# Altium project PWR_MNG.PRJPCB
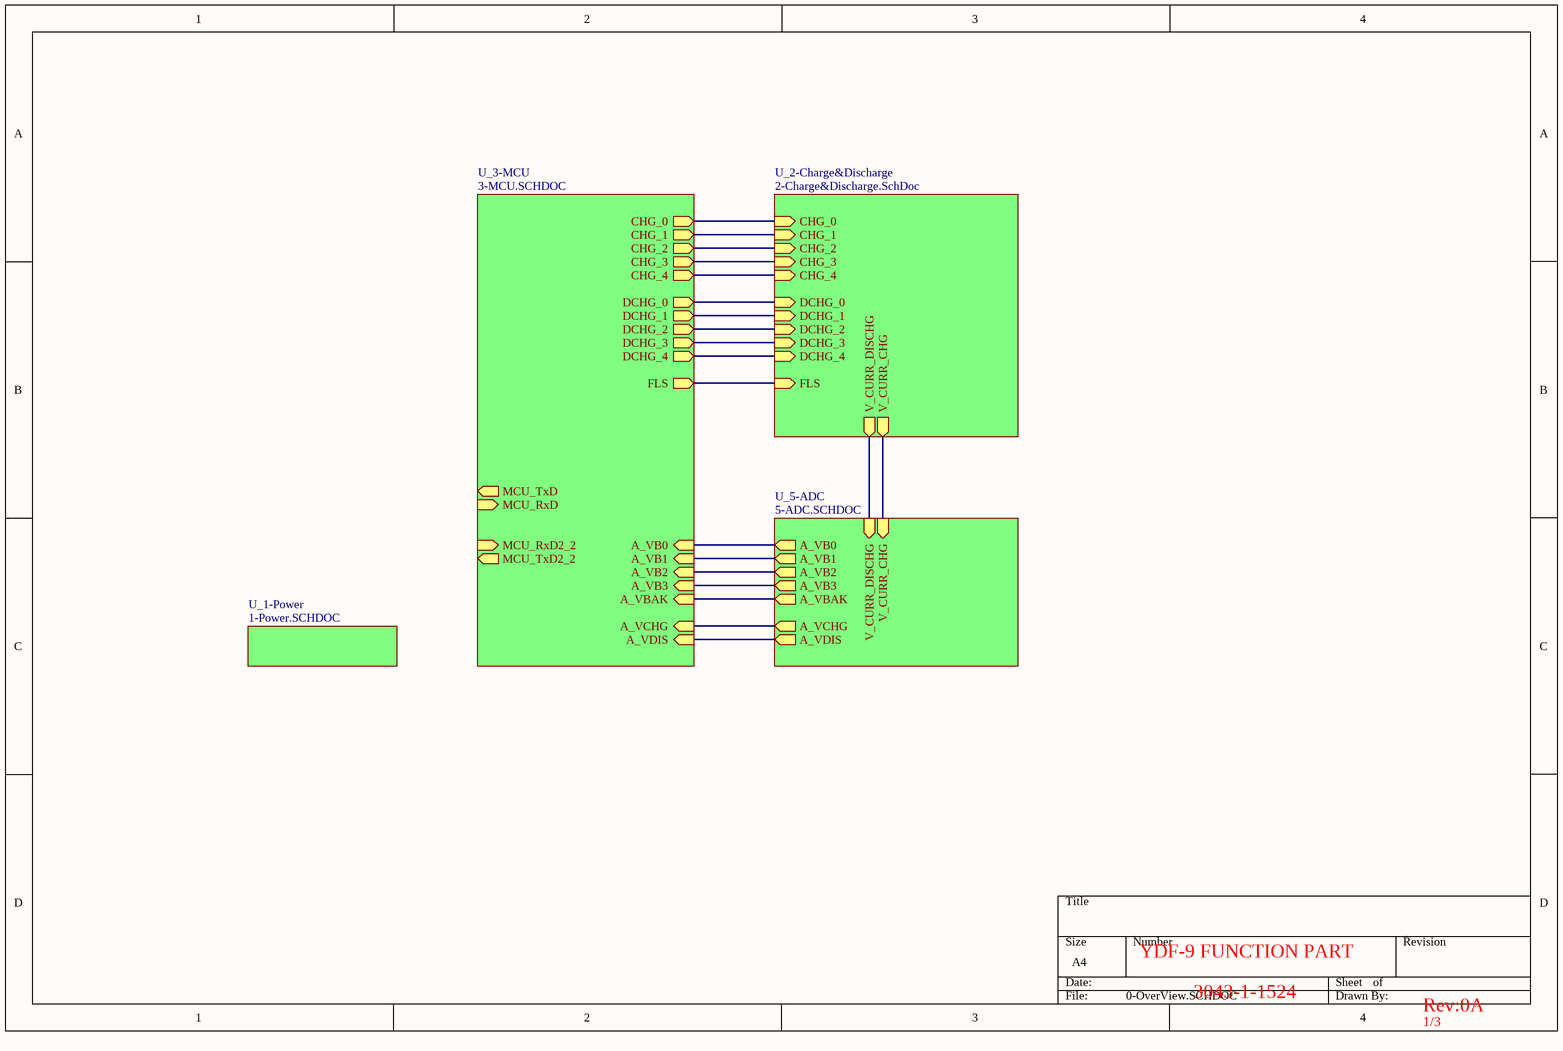
[diagram p0: 0-OverView.SCHDOC]
.TITLE: aaaaa
5 sheets, 60 parts. Net scope: hierarchical (ports join the sheet entries above them; power ports are global).
Board file: 3043-1-1552.PcbDoc
Sheets:
  0-OverView.SCHDOC
    U_2-Charge&Discharge = 2-Charge&Discharge.SchDoc
    U_1-Power = 1-Power.SCHDOC
    U_3-MCU = 3-MCU.SCHDOC
    U_5-ADC = 5-ADC.SCHDOC

## Sheet 0-OverView.SCHDOC
size A4

### Sub-sheets
U_1-Power = 1-Power.SCHDOC: no entries
U_2-Charge&Discharge = 2-Charge&Discharge.SchDoc: V_CURR_CHG (out), V_CURR_DISCHG (out), CHG_2 (in), CHG_3 (in), DCHG_0 (in), CHG_4 (in), CHG_0 (in), DCHG_1 (in), CHG_1 (in), DCHG_2 (in), DCHG_3 (in), DCHG_4 (in), FLS (in)
U_3-MCU = 3-MCU.SCHDOC: A_VDIS (in), A_VCHG (in), A_VB1 (in), A_VB2 (in), A_VB3 (in), MCU_RxD2_2 (in), MCU_TxD2_2 (out), MCU_RxD (in), CHG_3 (out), CHG_4 (out), CHG_0 (out), CHG_1 (out), CHG_2 (out), DCHG_0 (out), DCHG_1 (out), DCHG_2 (out), DCHG_3 (out), MCU_TxD (out), DCHG_4 (out), A_VB0 (in), A_VBAK (in), FLS (out)
U_5-ADC = 5-ADC.SCHDOC: A_VDIS (out), A_VB3 (out), A_VB1 (out), A_VCHG (out), A_VB2 (out), V_CURR_DISCHG (in), V_CURR_CHG (in), A_VB0 (out), A_VBAK (out)

### Nets
A_VB0: sheet U_3-MCU/A_VB0, sheet U_5-ADC/A_VB0
A_VB1: sheet U_3-MCU/A_VB1, sheet U_5-ADC/A_VB1
A_VB2: sheet U_3-MCU/A_VB2, sheet U_5-ADC/A_VB2
A_VB3: sheet U_3-MCU/A_VB3, sheet U_5-ADC/A_VB3
A_VBAK: sheet U_3-MCU/A_VBAK, sheet U_5-ADC/A_VBAK
A_VCHG: sheet U_2-Charge&Discharge/V_CURR_CHG, sheet U_3-MCU/A_VCHG, sheet U_5-ADC/A_VCHG, sheet U_5-ADC/V_CURR_CHG
A_VDIS: sheet U_2-Charge&Discharge/V_CURR_DISCHG, sheet U_3-MCU/A_VDIS, sheet U_5-ADC/A_VDIS, sheet U_5-ADC/V_CURR_DISCHG
CHG_0: sheet U_2-Charge&Discharge/CHG_0, sheet U_3-MCU/CHG_0
CHG_1: sheet U_2-Charge&Discharge/CHG_1, sheet U_3-MCU/CHG_1
CHG_2: sheet U_2-Charge&Discharge/CHG_2, sheet U_3-MCU/CHG_2
CHG_3: sheet U_2-Charge&Discharge/CHG_3, sheet U_3-MCU/CHG_3
CHG_4: sheet U_2-Charge&Discharge/CHG_4, sheet U_3-MCU/CHG_4
DCHG_0: sheet U_2-Charge&Discharge/DCHG_0, sheet U_3-MCU/DCHG_0
DCHG_1: sheet U_2-Charge&Discharge/DCHG_1, sheet U_3-MCU/DCHG_1
DCHG_2: sheet U_2-Charge&Discharge/DCHG_2, sheet U_3-MCU/DCHG_2
DCHG_3: sheet U_2-Charge&Discharge/DCHG_3, sheet U_3-MCU/DCHG_3
DCHG_4: sheet U_2-Charge&Discharge/DCHG_4, sheet U_3-MCU/DCHG_4
FLS: sheet U_2-Charge&Discharge/FLS, sheet U_3-MCU/FLS

### Notes on the sheet
- YDF-9 FUNCTION PART
- 3043-1-1524
- Rev:0A
- 1/3

## Sheet 2-Charge&Discharge.SchDoc
size A4
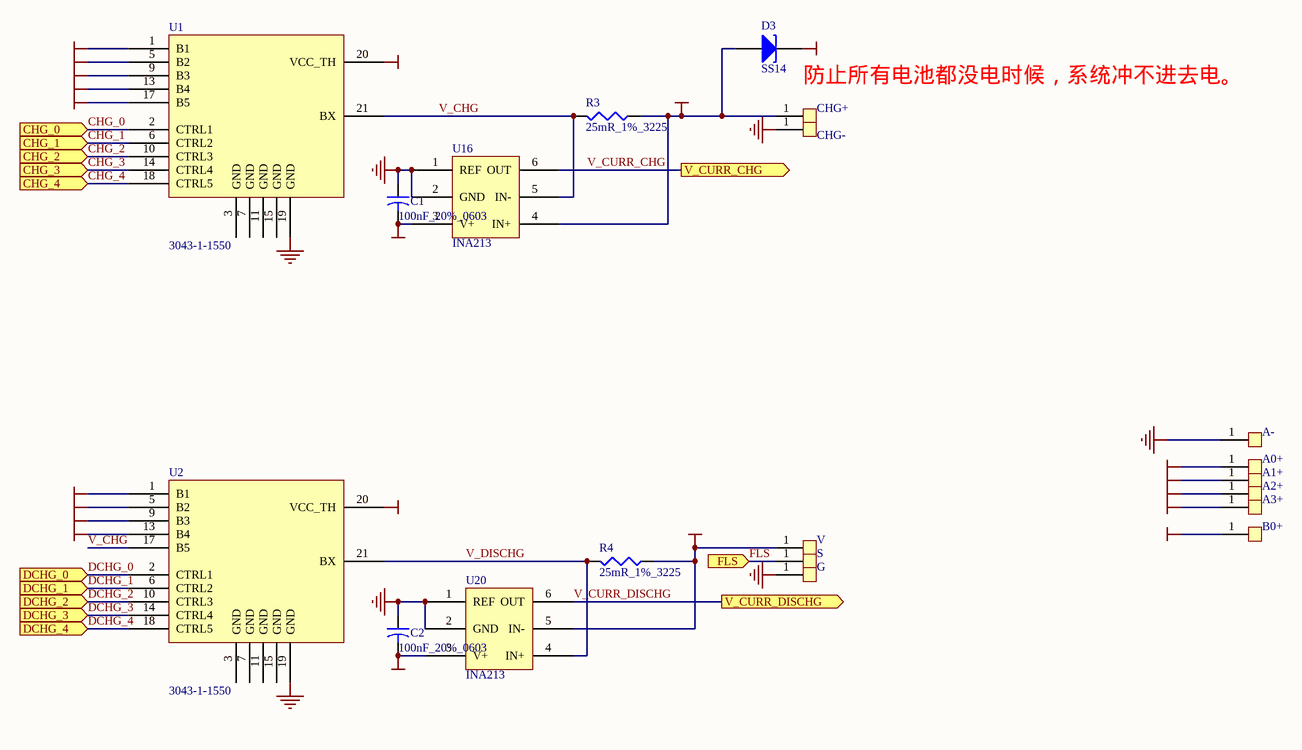
[diagram p1: 2-Charge&Discharge.SchDoc]

### Parts
A0+  ND  [END_1.5_2.8]  (value not drawn)
A1+  ND  [END_1.5_2.8]  (value not drawn)
A2+  ND  [END_1.5_2.8]  (value not drawn)
A3+  ND  [END_1.5_2.8]  (value not drawn)
A-  ND  [END_1.5_2.8]  (value not drawn)
B0+  ND  [END_1.5_2.8]  (value not drawn)
C1  100nF_20%_0603  [C1608-0603]
C2  100nF_20%_0603  [C1608-0603]
CHG+  ND  [END_1.5_2.8]  (value not drawn)
CHG-  ND  [END_1.5_2.8]  (value not drawn)
D3  SS14  [DO-214AB_SS14]
G  ND  [END_1.5_2.8]  (value not drawn)
R3  25mR_1%_3225  [CR6332-2512]
R4  25mR_1%_3225  [CR6332-2512]
S  ND  [END_1.5_2.8]  (value not drawn)
U1  3043-1-1550  [3043-1-1550_V1.10]
U2  3043-1-1550  [3043-1-1550_V1.10]
U16  INA213  [SC70-6]
U20  INA213  [SC70-6]
V  ND  [END_1.5_2.8]  (value not drawn)

### Ports
CHG_0 (in), CHG_1 (in), CHG_2 (in), CHG_3 (in), CHG_4 (in), DCHG_0 (in), DCHG_1 (in), DCHG_2 (in), DCHG_3 (in), DCHG_4 (in), FLS (in), V_CURR_CHG (out), V_CURR_DISCHG (out)

### Nets
GND: A-.1(SW) C1.1 C2.1 CHG-.1(SW) G.1(SW) U1.19(GND) U2.19(GND) U16.1(REF) U16.2(GND) U20.1(REF) U20.2(GND)
V_BAK: B0+.1(SW) D3.2(K) U1.17(B5)
V_BT0: A0+.1(SW) U1.1(B1) U2.1(B1)
V_BT1: A1+.1(SW) U1.5(B2) U2.5(B2)
V_BT2: A2+.1(SW) U1.9(B3) U2.9(B3)
V_BT3: A3+.1(SW) U1.13(B4) U2.13(B4)
VCC_2V8: C1.2 C2.2 U16.3(V+) U20.3(V+)
VCC_CHARGE: CHG+.1(SW) D3.1(A) R3.1 U16.4(IN+)
VCC_DIS: R4.1 U20.5(IN-) V.1(SW)
VCC_TH: U1.20(VCC_TH) U2.20(VCC_TH)
CHG_0: U1.2(CTRL1) ; port CHG_0
CHG_1: U1.6(CTRL2) ; port CHG_1
CHG_2: U1.10(CTRL3) ; port CHG_2
CHG_3: U1.14(CTRL4) ; port CHG_3
CHG_4: U1.18(CTRL5) ; port CHG_4
DCHG_0: U2.2(CTRL1) ; port DCHG_0
DCHG_1: U2.6(CTRL2) ; port DCHG_1
DCHG_2: U2.10(CTRL3) ; port DCHG_2
DCHG_3: U2.14(CTRL4) ; port DCHG_3
DCHG_4: U2.18(CTRL5) ; port DCHG_4
FLS: S.1(SW) ; port FLS
V_CHG: R3.2 U1.21(BX) U2.17(B5) U16.5(IN-)
V_CURR_CHG: U16.6(OUT) ; port V_CURR_CHG  [project net A_VCHG]
V_CURR_DISCHG: U20.6(OUT) ; port V_CURR_DISCHG  [project net A_VDIS]
V_DISCHG: R4.2 U2.21(BX) U20.4(IN+)

Not connected (* = marked no-connect by the designer): U1 3(GND) 7(GND) 11(GND) 15(GND); U2 3(GND) 7(GND) 11(GND) 15(GND)

### Notes on the sheet
- 防止所有电池都没电时候，系统冲不进去电。

### Library data of the parts
C1 C2 = Cap2: Capacitor; Value: 0.1uF 20% 0603; Published: 23-Sep-2002; Publisher: Altium Limited
D3 = D Tunnel1: Tunnel Diode - RLC Model; Published: 8-Jun-2000; LatestRevisionDate: 17-Jul-2002; LatestRevisionNote: Re-released for DXP Platform.; Publisher: Altium Limited
R3 R4 = Res3: Resistor; Value: 150R %5 0603; Published: 8-Jun-2000; Revision: July-2002: Re-released for DXP Platform.; Publisher: Altium Limited

## Sheet 1-Power.SCHDOC
size A4
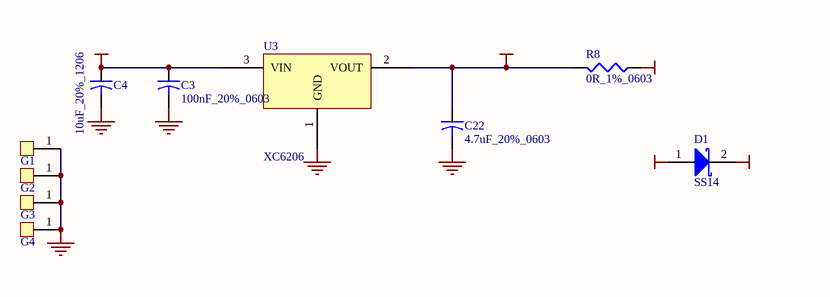
[diagram p2: 1-Power.SCHDOC]

### Parts
C3  100nF_20%_0603  [C1608-0603]
C4  10uF_20%_1206  [CC3216-1206]
C22  4.7uF_20%_0603  [C1608-0603]
D1  SS14  [LED0805]
G1  ND  [END_3_6]  (value not drawn)
G2  ND  [END_3_6]  (value not drawn)
G3  ND  [END_3_6]  (value not drawn)
G4  ND  [END_3_6]  (value not drawn)
R8  0R_1%_0603  [C1608-0603]
U3  XC6206  [SO-G3/C2.5]

### Nets
GND: C3.2 C4.2 C22.2 G1.1(SW) G2.1(SW) G3.1(SW) G4.1(SW) U3.1(GND)
VCC_2V8: C22.1 R8.2 U3.2(VOUT)
VCC_5V: C3.1 C4.1 D1.1(A) U3.3(VIN)
VCC_MCU: R8.1
VCC_TH: D1.2(K)

### Library data of the parts
C3 C4 C22 = Cap2: Capacitor; Value: 0.1uF 20% 0603; Published: 23-Sep-2002; Publisher: Altium Limited
D1 = D Schottky: Schottky Diode; Code - JEDEC: DO-214-AA; Published: 8-Jun-2000; Revision: July-2002: Re-released for DXP Platform.; Publisher: Altium Limited
R8 = Res3: Resistor; Value: 1K%5 0603; Published: 8-Jun-2000; Revision: July-2002: Re-released for DXP Platform.; Publisher: Altium Limited

## Sheet 3-MCU.SCHDOC
size A4
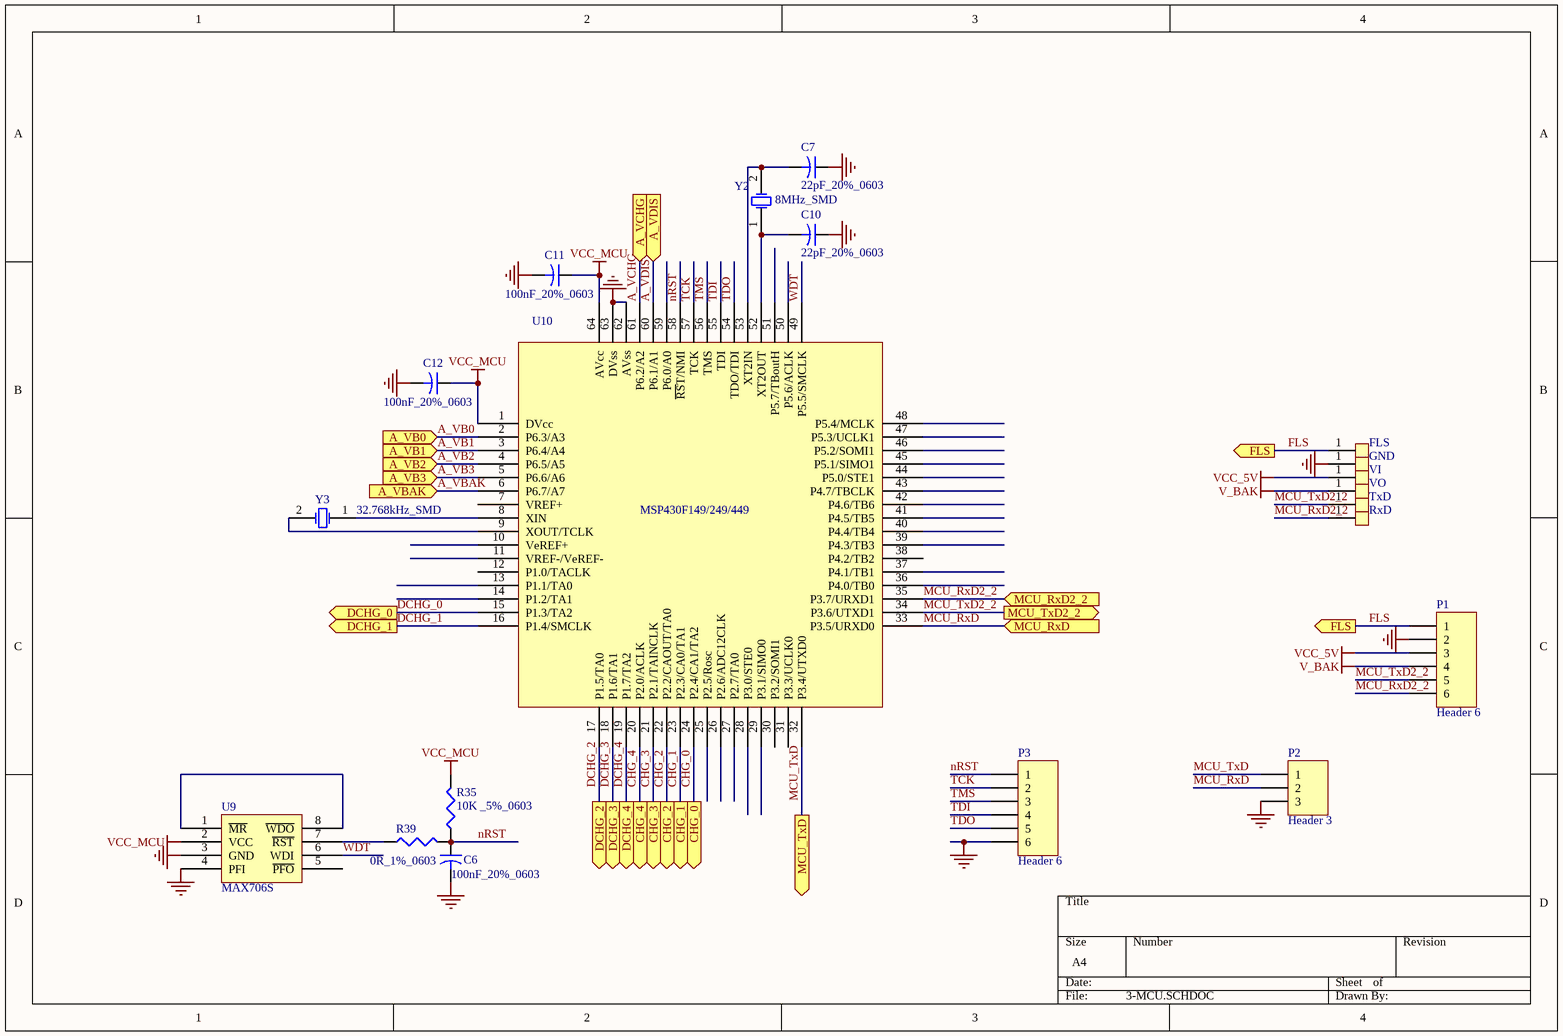
[diagram p3: 3-MCU.SCHDOC]

### Parts
C6  100nF_20%_0603  [C1608-0603]
C7  22pF_20%_0603  [C1608-0603]
C10  22pF_20%_0603  [C1608-0603]
C11  100nF_20%_0603  [C1608-0603]
C12  100nF_20%_0603  [C1608-0603]
FLS  ND  [END_1.5_2.8]  (value not drawn)
GND  ND  [END_1.5_2.8]  (value not drawn)
P1  Header 6  [XH-06H]
P2  Header 3  [XH-03H]
P3  Header 6  [SH-06S]
R35  10K _5%_0603  [C1608-0603]
R39  0R_1%_0603  [C1608-0603]
RxD  ND  [END_1.5_2.8]  (value not drawn)
TxD  ND  [END_1.5_2.8]  (value not drawn)
U9  MAX706S  [SO-8]
U10  MSP430F149/249/449  [QFP-64]
VI  ND  [END_1.5_2.8]  (value not drawn)
VO  ND  [END_1.5_2.8]  (value not drawn)
Y2  8MHz_SMD  [XTAL-P4mm_SMD]
Y3  32.768kHz_SMD  [XTAL-3216]

### Ports
A_VB0 (in), A_VB1 (in), A_VB2 (in), A_VB3 (in), A_VBAK (in), A_VCHG (in), A_VDIS (in), CHG_0 (out), CHG_1 (out), CHG_2 (out), CHG_3 (out), CHG_4 (out), DCHG_0 (out), DCHG_1 (out), DCHG_2 (out), DCHG_3 (out), DCHG_4 (out), FLS (out), MCU_RxD2_2 (in), MCU_RxD (in), MCU_TxD2_2 (out), MCU_TxD (out)

### Nets
GND: C6.2 C7.1 C10.1 C11.2 C12.2 GND.1(SW) P1.2 P2.3 P3.6 U9.3(GND) U9.4(PFI) U10.62(AVss) U10.63(DVss)
V_BAK: P1.4 VO.1(SW)
VCC_5V: P1.3 VI.1(SW)
VCC_MCU: C11.1 C12.1 R35.2 U9.2(VCC) U10.1(DVcc) U10.64(AVcc)
A_VB0: U10.2(P6.3/A3) ; port A_VB0
A_VB1: U10.3(P6.4/A4) ; port A_VB1
A_VB2: U10.4(P6.5/A5) ; port A_VB2
A_VB3: U10.5(P6.6/A6) ; port A_VB3
A_VBAK: U10.6(P6.7/A7) ; port A_VBAK
A_VCHG: U10.61(P6.2/A2) ; port A_VCHG
A_VDIS: U10.60(P6.1/A1) ; port A_VDIS
CHG_0: U10.24(P2.4/CA1/TA2) ; port CHG_0
CHG_1: U10.23(P2.3/CA0/TA1) ; port CHG_1
CHG_2: U10.22(P2.2/CAOUT/TA0) ; port CHG_2
CHG_3: U10.21(P2.1/TAINCLK) ; port CHG_3
CHG_4: U10.20(P2.0/ACLK) ; port CHG_4
DCHG_0: U10.15(P1.3/TA2) ; port DCHG_0
DCHG_1: U10.16(P1.4/SMCLK) ; port DCHG_1
DCHG_2: U10.17(P1.5/TA0) ; port DCHG_2
DCHG_3: U10.18(P1.6/TA1) ; port DCHG_3
DCHG_4: U10.19(P1.7/TA2) ; port DCHG_4
FLS: FLS.1(SW) P1.1 ; port FLS
MCU_RxD: P2.2 U10.33(P3.5/URXD0) ; port MCU_RxD
MCU_RxD2_2: P1.6 RxD.1(SW) U10.35(P3.7/URXD1) ; port MCU_RxD2_2
MCU_TxD: P2.1 U10.32(P3.4/UTXD0) ; port MCU_TxD
MCU_TxD2_2: P1.5 TxD.1(SW) U10.34(P3.6/UTXD1) ; port MCU_TxD2_2
nRST: C6.1 P3.1 R35.1 R39.2 U10.58(~{RS}T/NMI)
TCK: P3.2 U10.57(TCK)
TDI: P3.4 U10.55(TDI)
TDO: P3.5 U10.54(TDO/TDI)
TMS: P3.3 U10.56(TMS)
WDT: U9.6(WDI) U10.49(P5.5/SMCLK)
NetC7_2: C7.2 U10.53(XT2IN) Y2.2(OSC2)
NetC10_2: C10.2 U10.52(XT2OUT) Y2.1(OSC1)
NetR39_1: R39.1 U9.7(~{RST})
NetU9_1: U9.1(~{MR}) U9.8(~{WDO})
NetU10_8: U10.8(XIN) Y3.1(OSC1)
NetU10_9: U10.9(XOUT/TCLK) Y3.2(OSC2)

Not connected (* = marked no-connect by the designer): U9 5(~{PFO}); U10 7(VREF+) 10(VeREF+) 11(VREF-/VeREF-) 12(P1.0/TACLK) 13(P1.1/TA0) 14(P1.2/TA1) 25(P2.5/Rosc) 26(P2.6/ADC12CLK) 27(P2.7/TA0) 28(P3.0/STE0) 29(P3.1/SIMO0) 30(P3.2/SOMI1) 31(P3.3/UCLK0) 36(P4.0/TB0) 37(P4.1/TB1) 38(P4.2/TB2) 39(P4.3/TB3) 40(P4.4/TB4) 41(P4.5/TB5) 42(P4.6/TB6) 43(P4.7/TBCLK) 44(P5.0/STE1) 45(P5.1/SIMO1) 46(P5.2/SOMI1) 47(P5.3/UCLK1) 48(P5.4/MCLK) 50(P5.6/ACLK) 51(P5.7/TBoutH) 59(P6.0/A0)

### Library data of the parts
C6 = Cap2: Capacitor; Value: 0.1uF 0603; Published: 23-Sep-2002; Publisher: Altium Limited
C7 C10-C12 = Cap2: Capacitor; Value: 0.1uF 20% 0603; Published: 23-Sep-2002; Publisher: Altium Limited
P1 P3 = Header 6: Header, 6-Pin; LatestRevisionDate: 17-Jul-2002; LatestRevisionNote: Re-released for DXP Platform.; Publisher: Altium Limited
P2 = Header 3: Header, 3-Pin; LatestRevisionDate: 17-Jul-2002; LatestRevisionNote: Re-released for DXP Platform.; Publisher: Altium Limited
R35 R39 = Res3: Resistor; Value: 1M %5 0603_NC; Published: 8-Jun-2000; Revision: July-2002: Re-released for DXP Platform.; Publisher: Altium Limited
U9 = MAX706
Y2 Y3 = XTAL: Crystal Oscillator; Published: 8-Jun-2000; Revision: July-2002: Re-released for DXP Platform.; Publisher: Altium Limited

## Sheet 5-ADC.SCHDOC
size A4
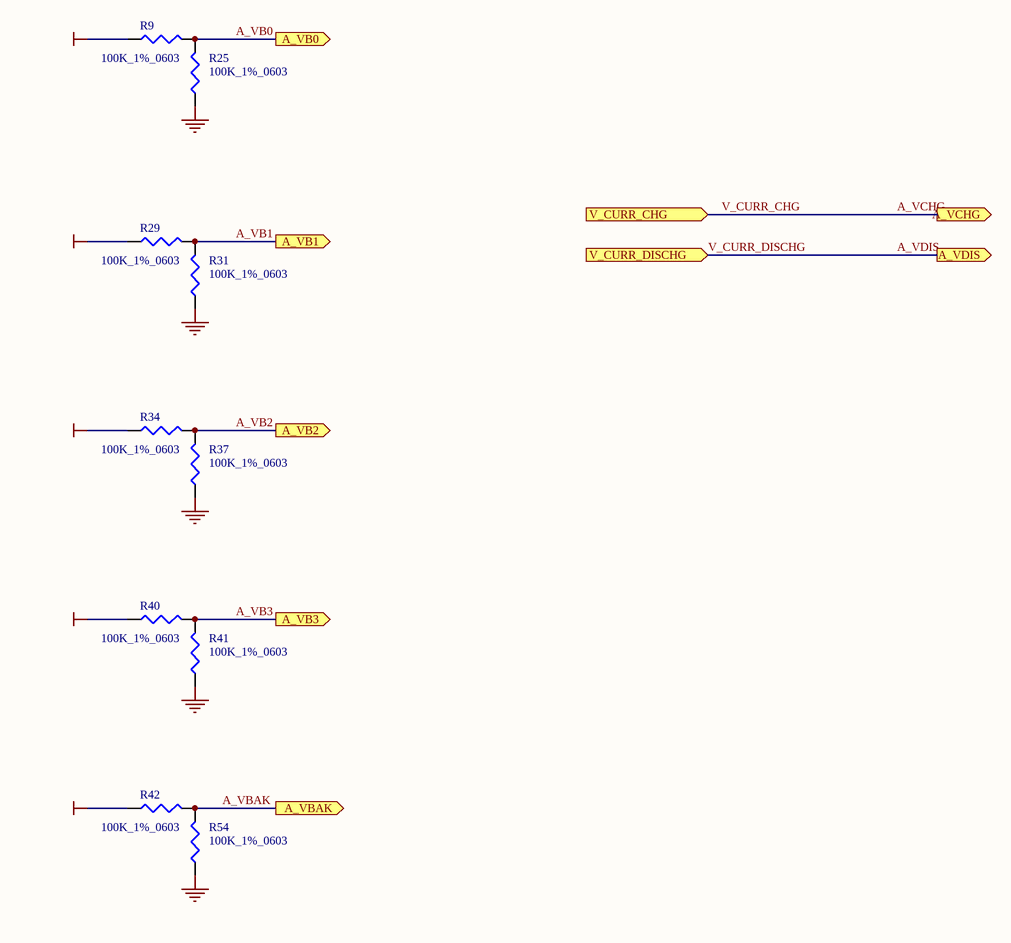
[diagram p4: 5-ADC.SCHDOC]

### Parts
R9  100K_1%_0603  [C1608-0603]
R25  100K_1%_0603  [C1608-0603]
R29  100K_1%_0603  [C1608-0603]
R31  100K_1%_0603  [C1608-0603]
R34  100K_1%_0603  [C1608-0603]
R37  100K_1%_0603  [C1608-0603]
R40  100K_1%_0603  [C1608-0603]
R41  100K_1%_0603  [C1608-0603]
R42  100K_1%_0603  [C1608-0603]
R54  100K_1%_0603  [C1608-0603]

### Ports
A_VB0 (out), A_VB1 (out), A_VB2 (out), A_VB3 (out), A_VBAK (out), A_VCHG (out), A_VDIS (out), V_CURR_CHG (in), V_CURR_DISCHG (in)

### Nets
GND: R25.1 R31.1 R37.1 R41.1 R54.1
V_BAK: R42.1
V_BT0: R9.1
V_BT1: R29.1
V_BT2: R34.1
V_BT3: R40.1
A_VB0: R9.2 R25.2 ; port A_VB0
A_VB1: R29.2 R31.2 ; port A_VB1
A_VB2: R34.2 R37.2 ; port A_VB2
A_VB3: R40.2 R41.2 ; port A_VB3
A_VBAK: R42.2 R54.2 ; port A_VBAK
A_VCHG: port A_VCHG, port V_CURR_CHG  [also labelled V_CURR_CHG]
A_VDIS: port A_VDIS, port V_CURR_DISCHG  [also labelled V_CURR_DISCHG]

### Library data of the parts
R9 R25 R29 R34 R40-R42 R54 = Res3: Resistor; Value: 100K 1% 0603; Published: 8-Jun-2000; Revision: July-2002: Re-released for DXP Platform.; Publisher: Altium Limited
R31 R37 = Res3: Resistor; Published: 8-Jun-2000; Revision: July-2002: Re-released for DXP Platform.; Publisher: Altium Limited; Value: 100K_1%_0603

## Nets that join several sheets
GND: 2-Charge&Discharge (11 pins), 1-Power (8 pins), 3-MCU (13 pins), 5-ADC (5 pins)
V_BAK: 2-Charge&Discharge (B0+.1 D3.2 U1.17), 3-MCU (P1.4 VO.1), 5-ADC (R42.1)
V_BT0: 2-Charge&Discharge (A0+.1 U1.1 U2.1), 5-ADC (R9.1)
V_BT1: 2-Charge&Discharge (A1+.1 U1.5 U2.5), 5-ADC (R29.1)
V_BT2: 2-Charge&Discharge (A2+.1 U1.9 U2.9), 5-ADC (R34.1)
V_BT3: 2-Charge&Discharge (A3+.1 U1.13 U2.13), 5-ADC (R40.1)
VCC_2V8: 2-Charge&Discharge (C1.2 C2.2 U16.3 U20.3), 1-Power (C22.1 R8.2 U3.2)
VCC_5V: 1-Power (C3.1 C4.1 D1.1 U3.3), 3-MCU (P1.3 VI.1)
VCC_MCU: 1-Power (R8.1), 3-MCU (6 pins)
VCC_TH: 2-Charge&Discharge (U1.20 U2.20), 1-Power (D1.2)
A_VB0: 3-MCU (U10.2), 5-ADC (R9.2 R25.2)
A_VB1: 3-MCU (U10.3), 5-ADC (R29.2 R31.2)
A_VB2: 3-MCU (U10.4), 5-ADC (R34.2 R37.2)
A_VB3: 3-MCU (U10.5), 5-ADC (R40.2 R41.2)
A_VBAK: 3-MCU (U10.6), 5-ADC (R42.2 R54.2)
A_VCHG: 2-Charge&Discharge (U16.6), 3-MCU (U10.61)
A_VDIS: 2-Charge&Discharge (U20.6), 3-MCU (U10.60)
CHG_0: 2-Charge&Discharge (U1.2), 3-MCU (U10.24)
CHG_1: 2-Charge&Discharge (U1.6), 3-MCU (U10.23)
CHG_2: 2-Charge&Discharge (U1.10), 3-MCU (U10.22)
CHG_3: 2-Charge&Discharge (U1.14), 3-MCU (U10.21)
CHG_4: 2-Charge&Discharge (U1.18), 3-MCU (U10.20)
DCHG_0: 2-Charge&Discharge (U2.2), 3-MCU (U10.15)
DCHG_1: 2-Charge&Discharge (U2.6), 3-MCU (U10.16)
DCHG_2: 2-Charge&Discharge (U2.10), 3-MCU (U10.17)
DCHG_3: 2-Charge&Discharge (U2.14), 3-MCU (U10.18)
DCHG_4: 2-Charge&Discharge (U2.18), 3-MCU (U10.19)
FLS: 2-Charge&Discharge (S.1), 3-MCU (FLS.1 P1.1)